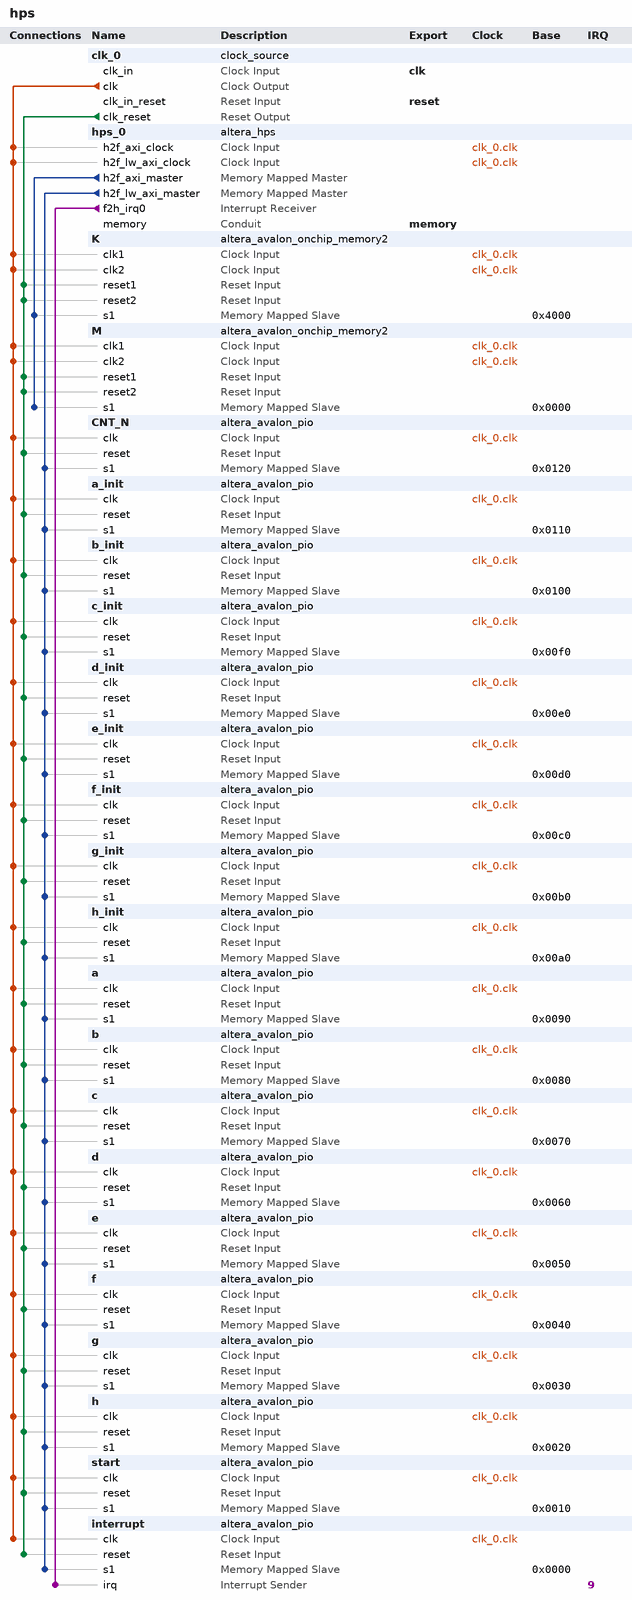
[diagram p0: system contents]
# Platform Designer (Qsys) system hps, Cyclone V 5CSEMA5F31C6
# Parameters at their usual value, and those the tool derives, are not listed.
package require -exact qsys 16.1
create_system hps
set_project_property DEVICE_FAMILY {Cyclone V}
set_project_property DEVICE 5CSEMA5F31C6

add_instance clk_0 clock_source 16.1
set_instance_parameter_value clk_0 clockFrequency 50000000

add_instance hps_0 altera_hps 16.1
set_instance_parameter_value hps_0 EMAC1_Mode N/A
set_instance_parameter_value hps_0 EMAC1_PinMuxing Unused
set_instance_parameter_value hps_0 F2SCLK_COLDRST_Enable false
set_instance_parameter_value hps_0 F2SCLK_DBGRST_Enable false
set_instance_parameter_value hps_0 F2SCLK_WARMRST_Enable false
set_instance_parameter_value hps_0 F2SINTERRUPT_Enable true
set_instance_parameter_value hps_0 F2S_Width 0
set_instance_parameter_value hps_0 FPGA_PERIPHERAL_OUTPUT_CLOCK_FREQ_EMAC0_GTX_CLK 125
set_instance_parameter_value hps_0 FPGA_PERIPHERAL_OUTPUT_CLOCK_FREQ_EMAC0_MD_CLK 2.5
set_instance_parameter_value hps_0 FPGA_PERIPHERAL_OUTPUT_CLOCK_FREQ_EMAC1_GTX_CLK 125
set_instance_parameter_value hps_0 FPGA_PERIPHERAL_OUTPUT_CLOCK_FREQ_EMAC1_MD_CLK 2.5
set_instance_parameter_value hps_0 HPS_PROTOCOL DDR3
set_instance_parameter_value hps_0 I2C0_Mode N/A
set_instance_parameter_value hps_0 I2C0_PinMuxing Unused
set_instance_parameter_value hps_0 I2C1_Mode N/A
set_instance_parameter_value hps_0 I2C1_PinMuxing Unused
set_instance_parameter_value hps_0 LWH2F_Enable true
set_instance_parameter_value hps_0 MEM_BANKADDR_WIDTH 3
set_instance_parameter_value hps_0 MEM_CLK_FREQ 300.0
set_instance_parameter_value hps_0 MEM_CLK_FREQ_MAX 400.0
set_instance_parameter_value hps_0 MEM_COL_ADDR_WIDTH 8
set_instance_parameter_value hps_0 MEM_DQ_WIDTH 8
set_instance_parameter_value hps_0 MEM_DRV_STR RZQ/6
set_instance_parameter_value hps_0 MEM_ROW_ADDR_WIDTH 12
set_instance_parameter_value hps_0 MEM_RTT_NOM {ODT Disabled}
set_instance_parameter_value hps_0 MEM_RTT_WR {Dynamic ODT off}
set_instance_parameter_value hps_0 MEM_TCL 7
set_instance_parameter_value hps_0 MEM_TFAW_NS 37.5
set_instance_parameter_value hps_0 MEM_TINIT_US 499
set_instance_parameter_value hps_0 MEM_TMRD_CK 3
set_instance_parameter_value hps_0 MEM_TRAS_NS 40.0
set_instance_parameter_value hps_0 MEM_TRCD_NS 15.0
set_instance_parameter_value hps_0 MEM_TREFI_US 7.0
set_instance_parameter_value hps_0 MEM_TRFC_NS 75.0
set_instance_parameter_value hps_0 MEM_TRP_NS 15.0
set_instance_parameter_value hps_0 MEM_TWTR 2
set_instance_parameter_value hps_0 MEM_VENDOR JEDEC
set_instance_parameter_value hps_0 MEM_WTCL 6
set_instance_parameter_value hps_0 MPU_EVENTS_Enable true
set_instance_parameter_value hps_0 QSPI_Mode N/A
set_instance_parameter_value hps_0 QSPI_PinMuxing Unused
set_instance_parameter_value hps_0 REF_CLK_FREQ 125.0
set_instance_parameter_value hps_0 S2FCLK_USER2CLK 5
set_instance_parameter_value hps_0 S2F_Width 3
set_instance_parameter_value hps_0 SDIO_Mode N/A
set_instance_parameter_value hps_0 SDIO_PinMuxing Unused
set_instance_parameter_value hps_0 SPIM1_Mode N/A
set_instance_parameter_value hps_0 SPIM1_PinMuxing Unused
set_instance_parameter_value hps_0 STM_Enable false
set_instance_parameter_value hps_0 TIMING_BOARD_AC_SKEW 0.02
set_instance_parameter_value hps_0 TIMING_BOARD_AC_TO_CK_SKEW 0.0
set_instance_parameter_value hps_0 TIMING_BOARD_DQ_TO_DQS_SKEW 0.0
set_instance_parameter_value hps_0 TIMING_BOARD_MAX_CK_DELAY 0.6
set_instance_parameter_value hps_0 TIMING_BOARD_MAX_DQS_DELAY 0.6
set_instance_parameter_value hps_0 TIMING_BOARD_SKEW_BETWEEN_DQS 0.02
set_instance_parameter_value hps_0 TIMING_BOARD_SKEW_CKDQS_DIMM_MAX 0.01
set_instance_parameter_value hps_0 TIMING_BOARD_SKEW_CKDQS_DIMM_MIN -0.01
set_instance_parameter_value hps_0 TIMING_BOARD_SKEW_WITHIN_DQS 0.02
set_instance_parameter_value hps_0 TIMING_TDH 125
set_instance_parameter_value hps_0 TIMING_TDQSCK 400
set_instance_parameter_value hps_0 TIMING_TDQSQ 120
set_instance_parameter_value hps_0 TIMING_TDS 50
set_instance_parameter_value hps_0 TIMING_TIH 250
set_instance_parameter_value hps_0 TIMING_TIS 175
set_instance_parameter_value hps_0 TIMING_TQSH 0.38
set_instance_parameter_value hps_0 UART0_Mode N/A
set_instance_parameter_value hps_0 UART0_PinMuxing Unused
set_instance_parameter_value hps_0 USB1_Mode N/A
set_instance_parameter_value hps_0 USB1_PinMuxing Unused
set_instance_parameter_value hps_0 desired_cfg_clk_mhz 100.0
set_instance_parameter_value hps_0 desired_qspi_clk_mhz 400.0

add_instance K altera_avalon_onchip_memory2 16.1
set_instance_parameter_value K dataWidth 128
set_instance_parameter_value K dualPort true
set_instance_parameter_value K initMemContent true
set_instance_parameter_value K initializationFileName onchip_mem.hex
set_instance_parameter_value K memorySize 256

add_instance M altera_avalon_onchip_memory2 16.1
set_instance_parameter_value M dataWidth 128
set_instance_parameter_value M dualPort true
set_instance_parameter_value M initMemContent true
set_instance_parameter_value M initializationFileName onchip_mem.hex
set_instance_parameter_value M memorySize 16384

add_instance CNT_N altera_avalon_pio 16.1
set_instance_parameter_value CNT_N direction InOut
set_instance_parameter_value CNT_N width 8

add_instance a_init altera_avalon_pio 16.1
set_instance_parameter_value a_init direction InOut
set_instance_parameter_value a_init width 32

add_instance b_init altera_avalon_pio 16.1
set_instance_parameter_value b_init direction InOut
set_instance_parameter_value b_init width 32

add_instance c_init altera_avalon_pio 16.1
set_instance_parameter_value c_init direction InOut
set_instance_parameter_value c_init width 32

add_instance d_init altera_avalon_pio 16.1
set_instance_parameter_value d_init direction InOut
set_instance_parameter_value d_init width 32

add_instance e_init altera_avalon_pio 16.1
set_instance_parameter_value e_init direction InOut
set_instance_parameter_value e_init width 32

add_instance f_init altera_avalon_pio 16.1
set_instance_parameter_value f_init direction InOut
set_instance_parameter_value f_init width 32

add_instance g_init altera_avalon_pio 16.1
set_instance_parameter_value g_init direction InOut
set_instance_parameter_value g_init width 32

add_instance h_init altera_avalon_pio 16.1
set_instance_parameter_value h_init direction InOut
set_instance_parameter_value h_init width 32

add_instance a altera_avalon_pio 16.1
set_instance_parameter_value a direction InOut
set_instance_parameter_value a width 32

add_instance b altera_avalon_pio 16.1
set_instance_parameter_value b direction InOut
set_instance_parameter_value b width 32

add_instance c altera_avalon_pio 16.1
set_instance_parameter_value c direction InOut
set_instance_parameter_value c width 32

add_instance d altera_avalon_pio 16.1
set_instance_parameter_value d direction InOut
set_instance_parameter_value d width 32

add_instance e altera_avalon_pio 16.1
set_instance_parameter_value e direction InOut
set_instance_parameter_value e width 32

add_instance f altera_avalon_pio 16.1
set_instance_parameter_value f direction InOut
set_instance_parameter_value f width 32

add_instance g altera_avalon_pio 16.1
set_instance_parameter_value g direction InOut
set_instance_parameter_value g width 32

add_instance h altera_avalon_pio 16.1
set_instance_parameter_value h direction InOut
set_instance_parameter_value h width 32

add_instance start altera_avalon_pio 16.1
set_instance_parameter_value start direction InOut
set_instance_parameter_value start width 1

add_instance interrupt altera_avalon_pio 16.1
set_instance_parameter_value interrupt direction InOut
set_instance_parameter_value interrupt generateIRQ true
set_instance_parameter_value interrupt width 1

# connections
add_connection clk_0.clk a.clk clock
add_connection clk_0.clk a_init.clk clock
add_connection clk_0.clk b.clk clock
add_connection clk_0.clk b_init.clk clock
add_connection clk_0.clk c.clk clock
add_connection clk_0.clk c_init.clk clock
add_connection clk_0.clk CNT_N.clk clock
add_connection clk_0.clk d.clk clock
add_connection clk_0.clk d_init.clk clock
add_connection clk_0.clk e.clk clock
add_connection clk_0.clk e_init.clk clock
add_connection clk_0.clk f.clk clock
add_connection clk_0.clk f_init.clk clock
add_connection clk_0.clk g.clk clock
add_connection clk_0.clk g_init.clk clock
add_connection clk_0.clk h.clk clock
add_connection clk_0.clk h_init.clk clock
add_connection clk_0.clk hps_0.h2f_axi_clock clock
add_connection clk_0.clk hps_0.h2f_lw_axi_clock clock
add_connection clk_0.clk interrupt.clk clock
add_connection clk_0.clk K.clk1 clock
add_connection clk_0.clk K.clk2 clock
add_connection clk_0.clk M.clk1 clock
add_connection clk_0.clk M.clk2 clock
add_connection clk_0.clk start.clk clock
add_connection clk_0.clk_reset a.reset reset
add_connection clk_0.clk_reset a_init.reset reset
add_connection clk_0.clk_reset b.reset reset
add_connection clk_0.clk_reset b_init.reset reset
add_connection clk_0.clk_reset c.reset reset
add_connection clk_0.clk_reset c_init.reset reset
add_connection clk_0.clk_reset CNT_N.reset reset
add_connection clk_0.clk_reset d.reset reset
add_connection clk_0.clk_reset d_init.reset reset
add_connection clk_0.clk_reset e.reset reset
add_connection clk_0.clk_reset e_init.reset reset
add_connection clk_0.clk_reset f.reset reset
add_connection clk_0.clk_reset f_init.reset reset
add_connection clk_0.clk_reset g.reset reset
add_connection clk_0.clk_reset g_init.reset reset
add_connection clk_0.clk_reset h.reset reset
add_connection clk_0.clk_reset h_init.reset reset
add_connection clk_0.clk_reset interrupt.reset reset
add_connection clk_0.clk_reset K.reset1 reset
add_connection clk_0.clk_reset K.reset2 reset
add_connection clk_0.clk_reset M.reset1 reset
add_connection clk_0.clk_reset M.reset2 reset
add_connection clk_0.clk_reset start.reset reset
add_connection hps_0.h2f_axi_master K.s1 avalon
set_connection_parameter_value hps_0.h2f_axi_master/K.s1 baseAddress 0x4000
add_connection hps_0.h2f_axi_master M.s1 avalon
set_connection_parameter_value hps_0.h2f_axi_master/M.s1 baseAddress 0x0000
add_connection hps_0.h2f_lw_axi_master a.s1 avalon
set_connection_parameter_value hps_0.h2f_lw_axi_master/a.s1 baseAddress 0x0090
add_connection hps_0.h2f_lw_axi_master a_init.s1 avalon
set_connection_parameter_value hps_0.h2f_lw_axi_master/a_init.s1 baseAddress 0x0110
add_connection hps_0.h2f_lw_axi_master b.s1 avalon
set_connection_parameter_value hps_0.h2f_lw_axi_master/b.s1 baseAddress 0x0080
add_connection hps_0.h2f_lw_axi_master b_init.s1 avalon
set_connection_parameter_value hps_0.h2f_lw_axi_master/b_init.s1 baseAddress 0x0100
add_connection hps_0.h2f_lw_axi_master c.s1 avalon
set_connection_parameter_value hps_0.h2f_lw_axi_master/c.s1 baseAddress 0x0070
add_connection hps_0.h2f_lw_axi_master c_init.s1 avalon
set_connection_parameter_value hps_0.h2f_lw_axi_master/c_init.s1 baseAddress 0x00f0
add_connection hps_0.h2f_lw_axi_master CNT_N.s1 avalon
set_connection_parameter_value hps_0.h2f_lw_axi_master/CNT_N.s1 baseAddress 0x0120
add_connection hps_0.h2f_lw_axi_master d.s1 avalon
set_connection_parameter_value hps_0.h2f_lw_axi_master/d.s1 baseAddress 0x0060
add_connection hps_0.h2f_lw_axi_master d_init.s1 avalon
set_connection_parameter_value hps_0.h2f_lw_axi_master/d_init.s1 baseAddress 0x00e0
add_connection hps_0.h2f_lw_axi_master e.s1 avalon
set_connection_parameter_value hps_0.h2f_lw_axi_master/e.s1 baseAddress 0x0050
add_connection hps_0.h2f_lw_axi_master e_init.s1 avalon
set_connection_parameter_value hps_0.h2f_lw_axi_master/e_init.s1 baseAddress 0x00d0
add_connection hps_0.h2f_lw_axi_master f.s1 avalon
set_connection_parameter_value hps_0.h2f_lw_axi_master/f.s1 baseAddress 0x0040
add_connection hps_0.h2f_lw_axi_master f_init.s1 avalon
set_connection_parameter_value hps_0.h2f_lw_axi_master/f_init.s1 baseAddress 0x00c0
add_connection hps_0.h2f_lw_axi_master g.s1 avalon
set_connection_parameter_value hps_0.h2f_lw_axi_master/g.s1 baseAddress 0x0030
add_connection hps_0.h2f_lw_axi_master g_init.s1 avalon
set_connection_parameter_value hps_0.h2f_lw_axi_master/g_init.s1 baseAddress 0x00b0
add_connection hps_0.h2f_lw_axi_master h.s1 avalon
set_connection_parameter_value hps_0.h2f_lw_axi_master/h.s1 baseAddress 0x0020
add_connection hps_0.h2f_lw_axi_master h_init.s1 avalon
set_connection_parameter_value hps_0.h2f_lw_axi_master/h_init.s1 baseAddress 0x00a0
add_connection hps_0.h2f_lw_axi_master interrupt.s1 avalon
set_connection_parameter_value hps_0.h2f_lw_axi_master/interrupt.s1 baseAddress 0x0000
add_connection hps_0.h2f_lw_axi_master start.s1 avalon
set_connection_parameter_value hps_0.h2f_lw_axi_master/start.s1 baseAddress 0x0010
add_connection hps_0.f2h_irq0 interrupt.irq interrupt
set_connection_parameter_value hps_0.f2h_irq0/interrupt.irq irqNumber 9

# exported interfaces
add_interface clk clock sink
set_interface_property clk EXPORT_OF clk_0.clk_in
add_interface memory conduit end
set_interface_property memory EXPORT_OF hps_0.memory
add_interface reset reset sink
set_interface_property reset EXPORT_OF clk_0.clk_in_reset

set_interconnect_requirement {$system} qsys_mm.clockCrossingAdapter HANDSHAKE
set_interconnect_requirement {$system} qsys_mm.enableEccProtection FALSE
set_interconnect_requirement {$system} qsys_mm.insertDefaultSlave FALSE
set_interconnect_requirement {$system} qsys_mm.maxAdditionalLatency 1

save_system hps.qsys
